# Altium project cheer_yourself_up_1.PrjPcb
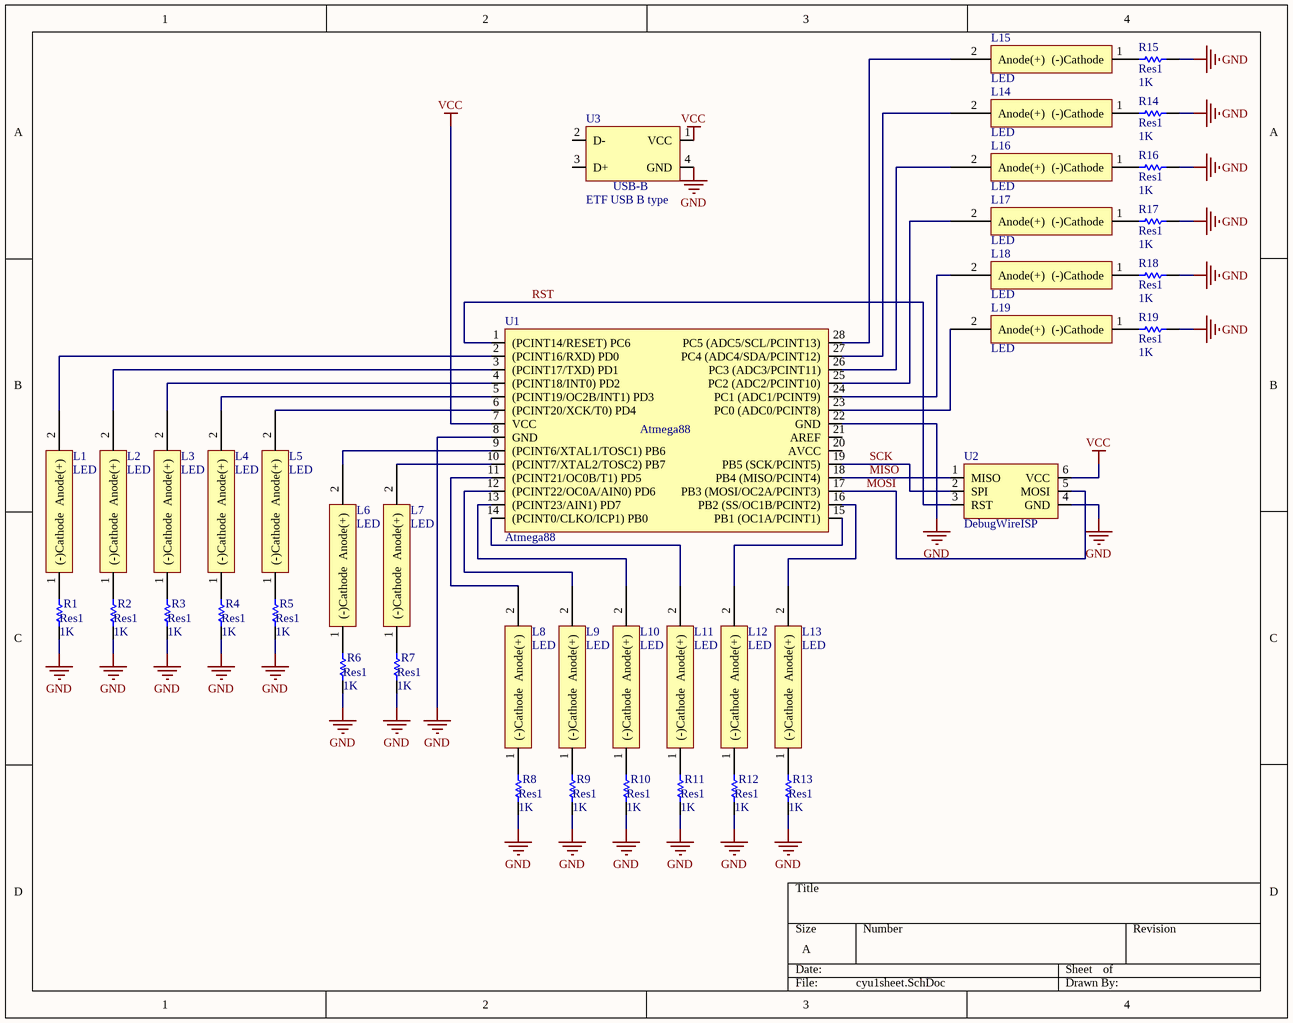
[diagram p0: cyu1sheet.SchDoc]
1 sheet, 41 parts. Net scope: global (net labels, ports and power ports of the same name join across sheets).
Board file: cyu1pcb.PcbDoc

## Sheet cyu1sheet.SchDoc
size A; SheetNumber: 1; SheetTotal: 1

### Parts
L1  LED  [LEDth]
L2  LED  [LEDth]
L3  LED  [LEDth]
L4  LED  [LEDth]
L5  LED  [LEDth]
L6  LED  [LEDth]
L7  LED  [LEDth]
L8  LED  [LEDth]
L9  LED  [LEDth]
L10  LED  [LEDth]
L11  LED  [LEDth]
L12  LED  [LEDth]
L13  LED  [LEDth]
L14  LED  [LEDth]
L15  LED  [LEDth]
L16  LED  [LEDth]
L17  LED  [LEDth]
L18  LED  [LEDth]
L19  LED  [LEDth]
R1  Res1  value 1K  [AXIAL-0.3]
R2  Res1  value 1K  [AXIAL-0.3]
R3  Res1  value 1K  [AXIAL-0.3]
R4  Res1  value 1K  [AXIAL-0.3]
R5  Res1  value 1K  [AXIAL-0.3]
R6  Res1  value 1K  [AXIAL-0.3]
R7  Res1  value 1K  [AXIAL-0.3]
R8  Res1  value 1K  [AXIAL-0.3]
R9  Res1  value 1K  [AXIAL-0.3]
R10  Res1  value 1K  [AXIAL-0.3]
R11  Res1  value 1K  [AXIAL-0.3]
R12  Res1  value 1K  [AXIAL-0.3]
R13  Res1  value 1K  [AXIAL-0.3]
R14  Res1  value 1K  [AXIAL-0.3]
R15  Res1  value 1K  [AXIAL-0.3]
R16  Res1  value 1K  [AXIAL-0.3]
R17  Res1  value 1K  [AXIAL-0.3]
R18  Res1  value 1K  [AXIAL-0.3]
R19  Res1  value 1K  [AXIAL-0.3]
U1  Atmega88  [ATMEGA328]
U2  DebugWireISP  [6x2pinheader]
U3  ETF USB B type  [USB-B]

### Nets
GND: R1.1 R2.1 R3.1 R4.1 R5.1 R6.1 R7.1 R8.1 R9.1 R10.1 R11.1 R12.1 R13.1 R14.1 R15.1 R16.1 R17.1 R18.1 R19.1 U1.8(GND) U1.22(GND) U2.4(GND) U3.4(GND)
VCC: U1.7(VCC) U2.6(VCC) U3.1(VCC)
MISO: U1.18(PB4_(MISO/PCINT4)) U2.1(MISO)
MOSI: U1.17(PB3_(MOSI/OC2A/PCINT3)) U2.5(MOSI)
RST: U1.1((PCINT14/RESET)_PC6) U2.3(RST)
SCK: U1.19(PB5_(SCK/PCINT5)) U2.2(SPI)
NetL1_1: L1.1((-)Cathode) R1.2
NetL1_2: L1.2(Anode(+)) U1.2((PCINT16/RXD)_PD0)
NetL2_1: L2.1((-)Cathode) R2.2
NetL2_2: L2.2(Anode(+)) U1.3((PCINT17/TXD)_PD1)
NetL3_1: L3.1((-)Cathode) R3.2
NetL3_2: L3.2(Anode(+)) U1.4((PCINT18/INT0)_PD2)
NetL4_1: L4.1((-)Cathode) R4.2
NetL4_2: L4.2(Anode(+)) U1.5((PCINT19/OC2B/INT1)_PD3)
NetL5_1: L5.1((-)Cathode) R5.2
NetL5_2: L5.2(Anode(+)) U1.6((PCINT20/XCK/T0)_PD4)
NetL6_1: L6.1((-)Cathode) R6.2
NetL6_2: L6.2(Anode(+)) U1.9((PCINT6/XTAL1/TOSC1)_PB6)
NetL7_1: L7.1((-)Cathode) R7.2
NetL7_2: L7.2(Anode(+)) U1.10((PCINT7/XTAL2/TOSC2)_PB7)
NetL8_1: L8.1((-)Cathode) R8.2
NetL8_2: L8.2(Anode(+)) U1.11((PCINT21/OC0B/T1)_PD5)
NetL9_1: L9.1((-)Cathode) R9.2
NetL9_2: L9.2(Anode(+)) U1.12((PCINT22/OC0A/AIN0)_PD6)
NetL10_1: L10.1((-)Cathode) R10.2
NetL10_2: L10.2(Anode(+)) U1.13((PCINT23/AIN1)_PD7)
NetL11_1: L11.1((-)Cathode) R11.2
NetL11_2: L11.2(Anode(+)) U1.14((PCINT0/CLKO/ICP1)_PB0)
NetL12_1: L12.1((-)Cathode) R12.2
NetL12_2: L12.2(Anode(+)) U1.15(PB1_(OC1A/PCINT1))
NetL13_1: L13.1((-)Cathode) R13.2
NetL13_2: L13.2(Anode(+)) U1.16(PB2_(SS/OC1B/PCINT2))
NetL14_1: L14.1((-)Cathode) R14.2
NetL14_2: L14.2(Anode(+)) U1.27(PC4_(ADC4/SDA/PCINT12))
NetL15_1: L15.1((-)Cathode) R15.2
NetL15_2: L15.2(Anode(+)) U1.28(PC5_(ADC5/SCL/PCINT13))
NetL16_1: L16.1((-)Cathode) R16.2
NetL16_2: L16.2(Anode(+)) U1.26(PC3_(ADC3/PCINT11))
NetL17_1: L17.1((-)Cathode) R17.2
NetL17_2: L17.2(Anode(+)) U1.25(PC2_(ADC2/PCINT10))
NetL18_1: L18.1((-)Cathode) R18.2
NetL18_2: L18.2(Anode(+)) U1.24(PC1_(ADC1/PCINT9))
NetL19_1: L19.1((-)Cathode) R19.2
NetL19_2: L19.2(Anode(+)) U1.23(PC0_(ADC0/PCINT8))

Not connected (* = marked no-connect by the designer): U1 20(AVCC) 21(AREF); U3 2(D-) 3(D+)

### Library data of the parts
L1-L19 = LEDth: Value: Red
R1-R19 = Res1: Resistor; Published: 8-Jun-2000; LatestRevisionDate: 17-Jul-2002; LatestRevisionNote: Re-released for DXP Platform.; PackageReference: AXIAL-0.3; Publisher: Altium Limited; PackageDescription: Axial Device, Thru-Hole; 2 Leads; 0.3 in Pin Spacing
U3 = USB-B: Value: Yes